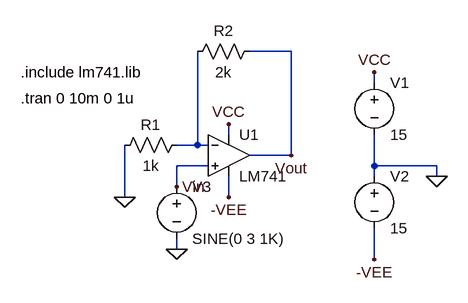
[diagram p0: schematic 1_noninvering_amplifier.asc]
1_noninvering_amplifier.asc, the LTspice schematic file:
Version 4
SHEET 1 880 680
WIRE 272 16 208 16
WIRE 400 64 400 48
WIRE 176 144 176 128
WIRE 128 160 128 16
WIRE 128 160 96 160
WIRE 144 160 128 160
WIRE 272 176 272 16
WIRE 272 176 208 176
WIRE 144 192 96 192
WIRE 400 192 400 144
WIRE 496 192 400 192
WIRE 400 208 400 192
WIRE 496 208 496 192
WIRE 96 224 96 192
WIRE 16 240 16 160
WIRE 176 240 176 208
WIRE 96 320 96 304
WIRE 400 336 400 288
FLAG 496 208 0
FLAG 16 240 0
FLAG 96 320 0
FLAG 96 224 Vin
FLAG 272 176 Vout
FLAG 176 128 VCC
FLAG 400 48 VCC
FLAG 176 240 -VEE
FLAG 400 336 -VEE
SYMBOL voltage 400 48 R0
WINDOW 123 0 0 Left 0
WINDOW 39 0 0 Left 0
SYMATTR InstName V1
SYMATTR Value 15
SYMBOL voltage 400 192 R0
WINDOW 123 0 0 Left 0
WINDOW 39 0 0 Left 0
SYMATTR InstName V2
SYMATTR Value 15
SYMBOL res 112 144 R90
WINDOW 0 0 56 VBottom 2
WINDOW 3 32 56 VTop 2
SYMATTR InstName R1
SYMATTR Value 1k
SYMBOL voltage 96 208 R0
WINDOW 123 0 0 Left 0
WINDOW 39 0 0 Left 0
SYMATTR InstName V3
SYMATTR Value SINE(0 3 1K)
SYMBOL res 224 0 R90
WINDOW 0 0 56 VBottom 2
WINDOW 3 32 56 VTop 2
SYMATTR InstName R2
SYMATTR Value 2k
SYMBOL OpAmps\\opamp2 176 112 R0
SYMATTR InstName U1
SYMATTR Value LM741
TEXT -144 88 Left 2 !.tran 0 10m 0 1u
TEXT -144 48 Left 2 !.include lm741.lib

The netlist it stands for:
* 1_noninvering_amplifier.asc
V1 VCC 0 15
V2 0 -VEE 15
R1 N001 0 1k
V3 Vin 0 SINE(0 3 1K)
R2 Vout N001 2k
XU1 Vin N001 VCC -VEE Vout LM741  ; pins In+ In- V+ V- OUT
.tran 0 10m 0 1u
.include lm741.lib
.backanno
.end